# EAGLE schematic PROJECT BEL RUMAH (EAGLE 9.6.2)
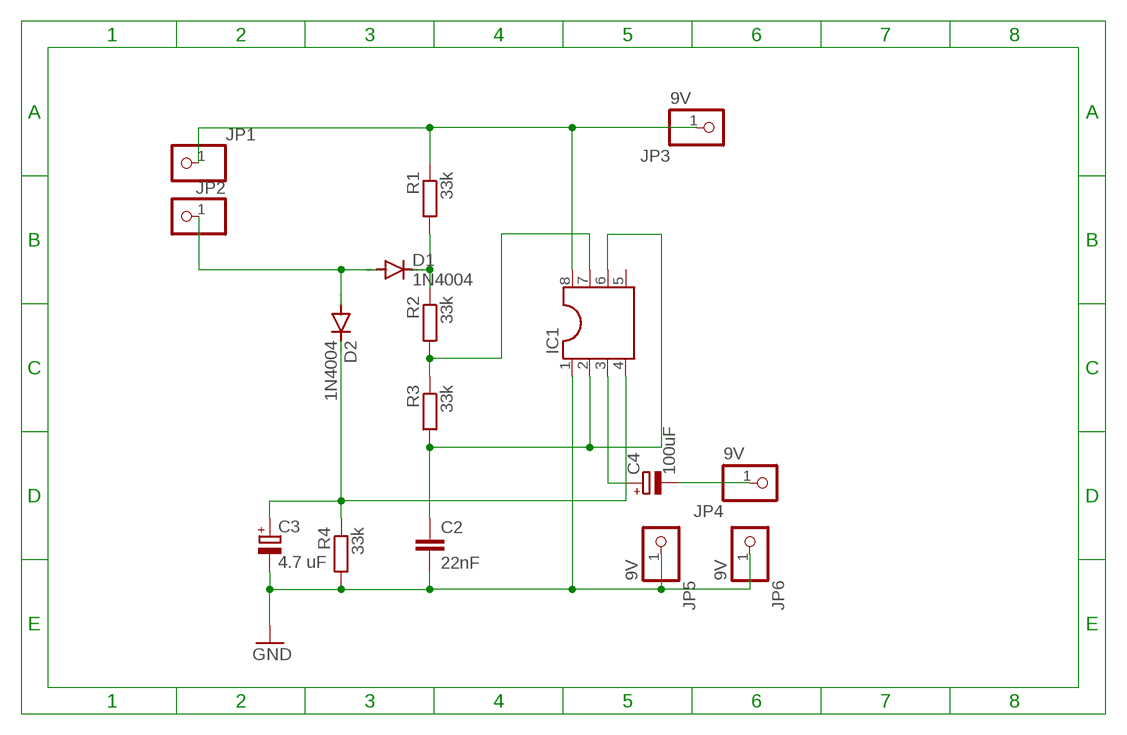
[diagram p0: schematic, sheet 1]

## Parts
C2  22nF  C-EU025-024X044  [C025-024X044]
C3  4.7 uF  CPOL-EUE2,5-6E  [E2,5-6E]
C4  100uF  CPOL-EUE2,5-6E  [E2,5-6E]
D1  1N4004  [DO41-10]
D2  1N4004  [DO41-10]
IC1  DIL8  [DIL08]
JP1  PINHD-1X1  [1X01]
JP2  PINHD-1X1  [1X01]
JP3  9V  PINHD-1X1  [1X01]
JP4  9V  PINHD-1X1  [1X01]
JP5  9V  PINHD-1X1  [1X01]
JP6  9V  PINHD-1X1  [1X01]
R1  33k  R-EU_0204/5  [0204/5]
R2  33k  R-EU_0204/5  [0204/5]
R3  33k  R-EU_0204/5  [0204/5]
R4  33k  R-EU_0204/5  [0204/5]

## Nets
GND: C2.2 C3.- IC1.1 JP5.1 JP6.1 R4.2
N$1: IC1.8 JP1.1 JP3.1 R1.1
N$2: D1.C R1.2 R2.1
N$3: D1.A D2.A JP2.1
N$5: C4.- JP4.1
N$6: IC1.7 R2.2 R3.1
N$7: C2.1 IC1.2 IC1.6 R3.2
N$9: C4.+ IC1.3
N$10: C3.+ D2.C IC1.4 R4.1
Unconnected: IC1.5

## Library data of the parts
C2 = rcl:C-EU: CAPACITOR, European symbol; SPICEPREFIX: C
C3 C4 = rcl:CPOL-EU: POLARIZED CAPACITOR, European symbol; SPICEPREFIX: C
D1 D2 = diode:1N4004: DIODE general purpose rectifier, 1 A
IC1 = ic-package:DIL8: Dual In Line / Socket
JP1-JP6 = pinhead:PINHD-1X1: PIN HEADER
R1-R4 = rcl:R-EU_: RESISTOR, European symbol; SPICEPREFIX: R